# Altium schematic sheet mcu_and_input_power.SchDoc
size A2; SheetNumber: 2; SheetTotal: 2
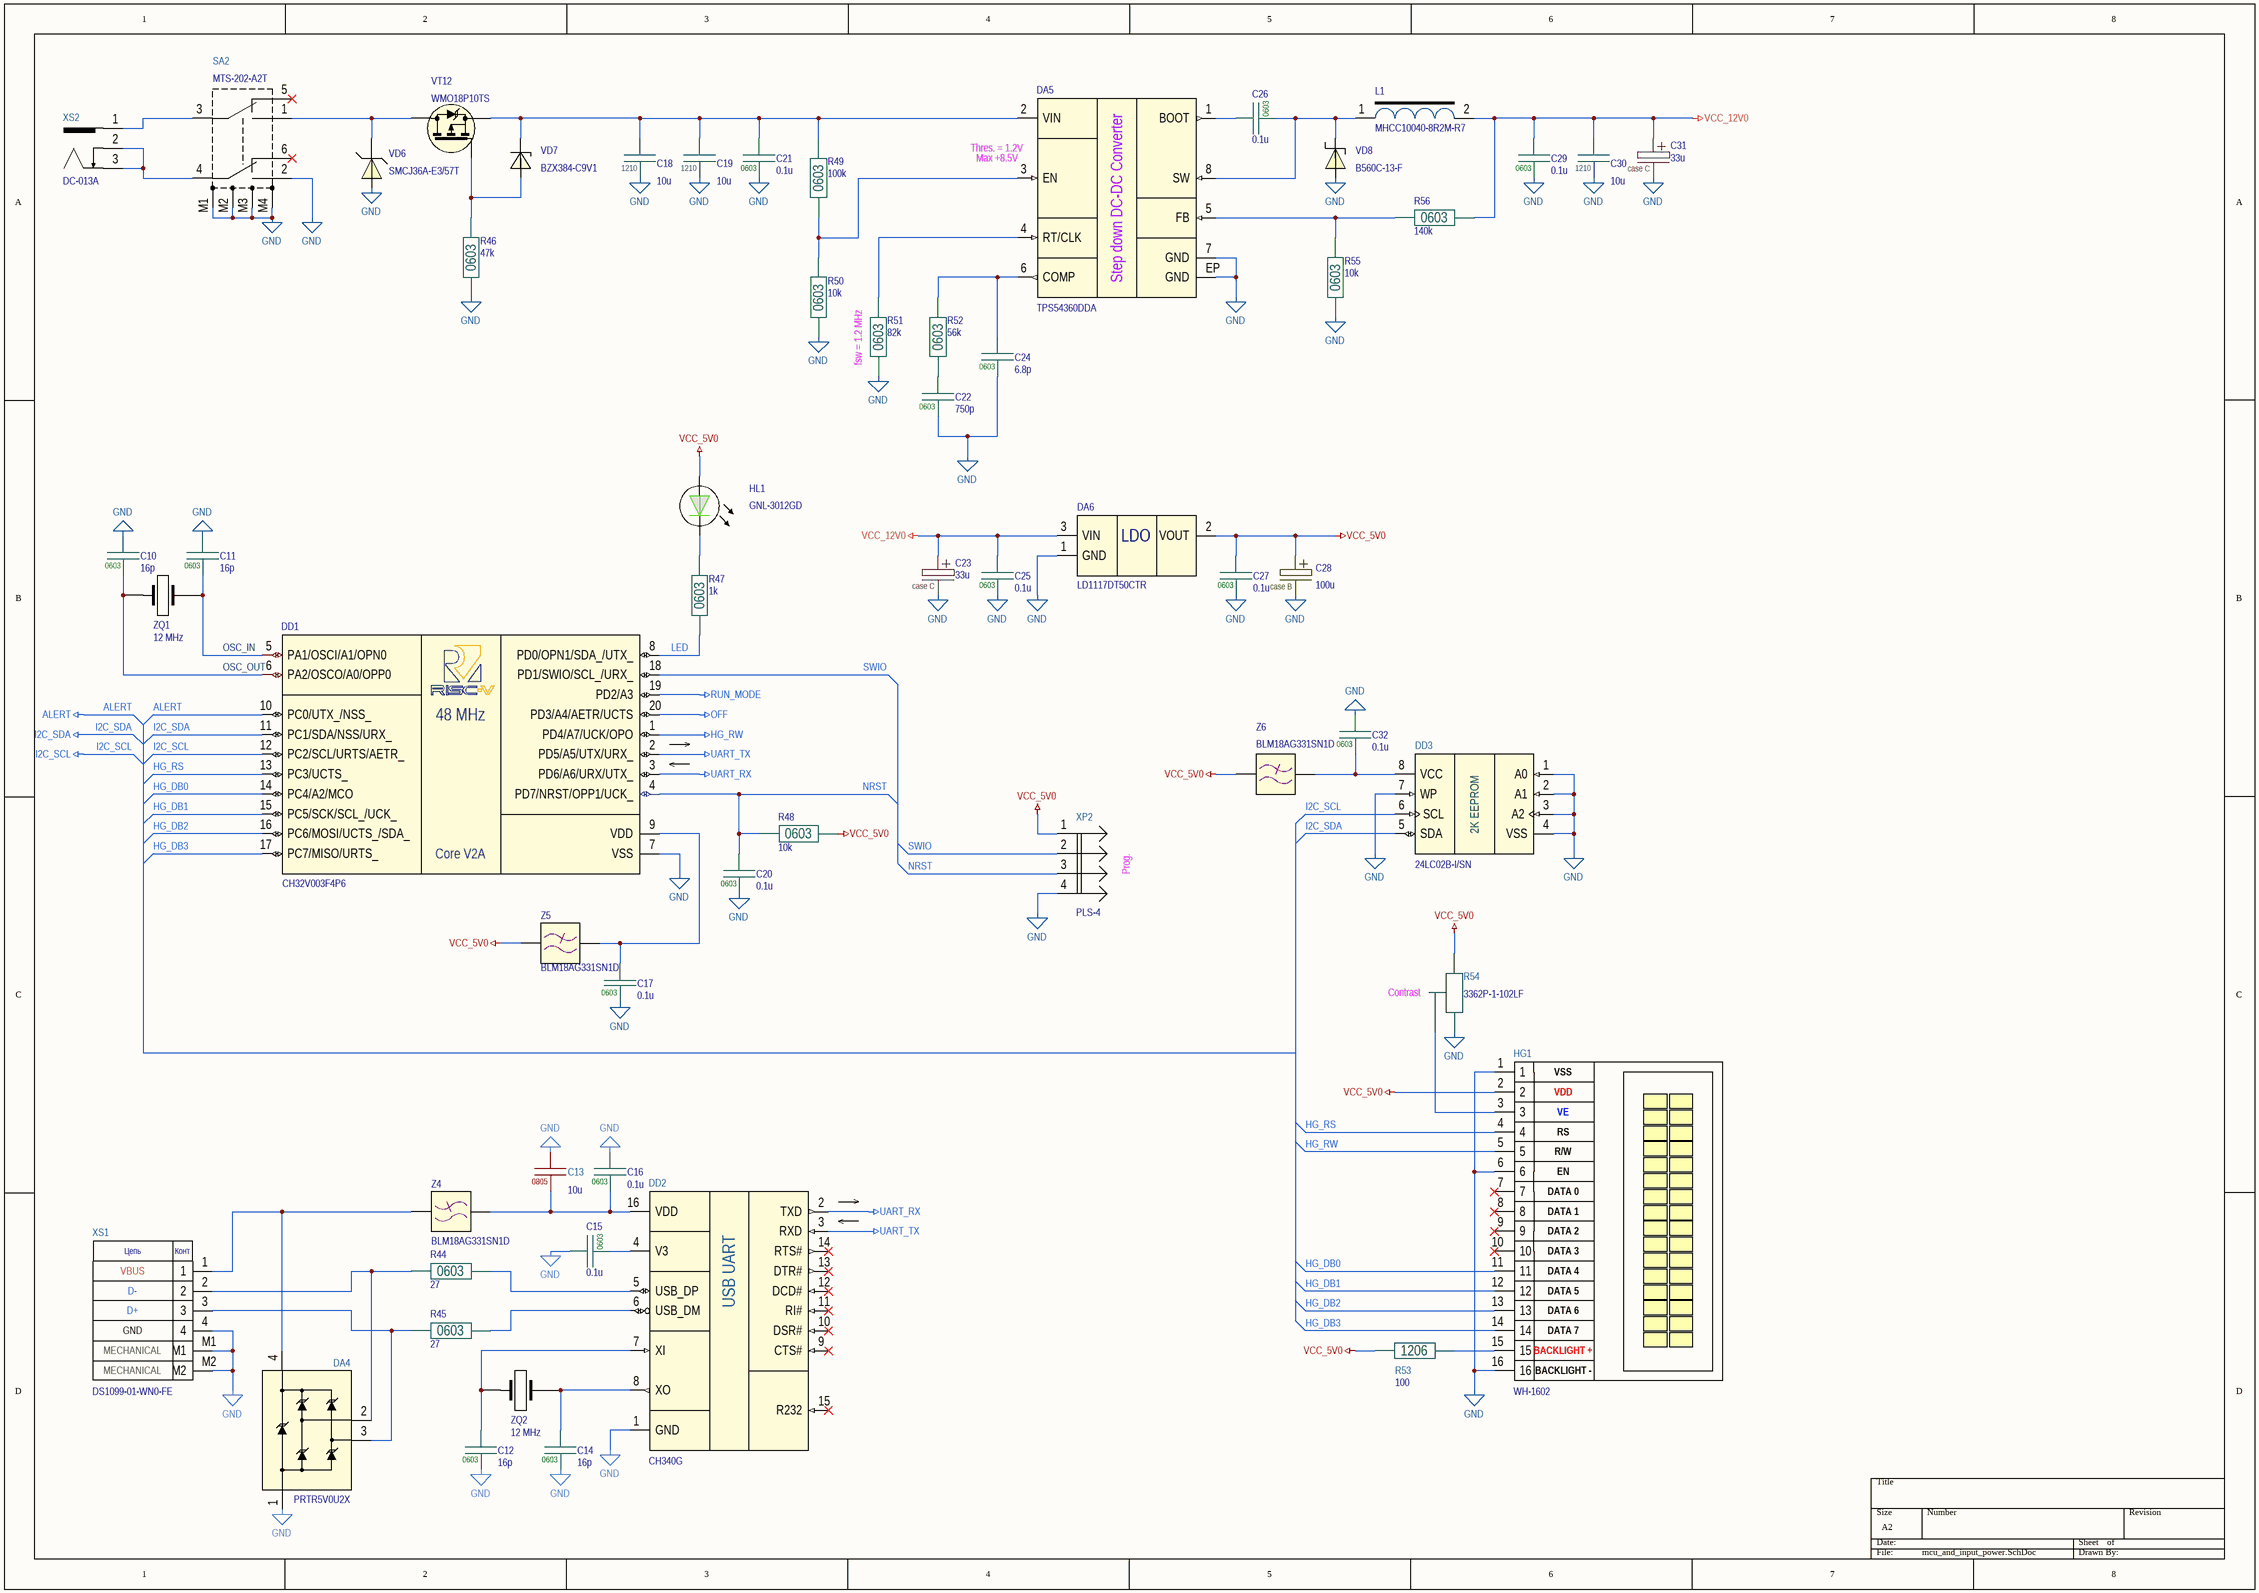
[diagram p0: mcu_and_input_power.SchDoc]

## Parts
C10  16p  Package: 0603  [CAP0603]
C11  16p  Package: 0603  [CAP0603]
C12  16p  Package: 0603  [CAP0603]
C13  10u  Package: 0805  [CAP0805-0.75]
C14  16p  Package: 0603  [CAP0603]
C15  0.1u  Package: 0603  [CAP0603]
C16  0.1u  Package: 0603  [CAP0603]
C17  0.1u  Package: 0603  [CAP0603]
C18  10u  Package: 1210  [CAP1210-2.2]
C19  10u  Package: 1210  [CAP1210-2.2]
C20  0.1u  Package: 0603  [CAP0603]
C21  0.1u  Package: 0603  [CAP0603]
C22  750p  Package: 0603  [CAP0603]
C23  33u  Package: case C  [CAP_CASE_C]
C24  6.8p  Package: 0603  [CAP0603]
C25  0.1u  Package: 0603  [CAP0603]
C26  0.1u  Package: 0603  [CAP0603]
C27  0.1u  Package: 0603  [CAP0603]
C28  100u  Package: case B  [CAP_CASE_B]
C29  0.1u  Package: 0603  [CAP0603]
C30  10u  Package: 1210  [CAP1210-2.2]
C31  33u  Package: case C  [CAP_CASE_C]
C32  0.1u  Package: 0603  [CAP0603]
DA4  PRTR5V0U2X  [SOT143]
DA5  TPS54360DDA  [SOIC-8EP]
DA6  LD1117DT50CTR  [TO-252-3]
DD1  CH32V003F4P6  [TSSOP-20]
DD2  CH340G  [SOIC-16]
DD3  24LC02B-I/SN  [SOIC-8]
HG1  WH-1602  [WH1602]
HL1  GNL-3012GD  [GNL-3012GD]
L1  MHCC10040-8R2M-R7  [MHCC10040]
R44  27  Package: 0603  [RES0603B]
R45  27  Package: 0603  [RES0603B]
R46  47k  Package: 0603  [RES0603B]
R47  1k  Package: 0603  [RES0603B]
R48  10k  Package: 0603  [RES0603B]
R49  100k  Package: 0603  [RES0603B]
R50  10k  Package: 0603  [RES0603B]
R51  82k  Package: 0603  [RES0603B]
R52  56k  Package: 0603  [RES0603B]
R53  100  Package: 1206  [RES1206C]
R54  3362P-1-102LF  [3362P]
R55  10k  Package: 0603  [RES0603B]
R56  140k  Package: 0603  [RES0603B]
SA2  MTS-202-A2T  [MTS-202-A2T]
VD6  SMCJ36A-E3/57T  [DO-214AB]
VD7  BZX384-C9V1  [SOD-323]
VD8  B560C-13-F  [DO-214AB]
VT12  WMO18P10TS  [TO-252-3]
XP2  PLS-4  [PLS-4]
XS1  DS1099-01-WN0-FE  [DS1099-01-WN0-FE]
XS2  DC-013A  [DC-013A]
Z4  BLM18AG331SN1D  [BLM0603P]
Z5  BLM18AG331SN1D  [BLM0603P]
Z6  BLM18AG331SN1D  [BLM0603P]
ZQ1  Frequency: 12 MHz  [HC-49/US_With_Hole]  (hidden comment: SJK-6C-12.000-16-30-50-B-50-H)
ZQ2  Frequency: 12 MHz  [HC-49/US_With_Hole]  (hidden comment: SJK-6C-12.000-16-30-50-B-50-H)

## Nets
ALERT: DD1.10(PC0/UTX_/NSS_)
GND: C10.2 C11.2 C12.1 C13.2 C14.1 C15.2 C16.2 C17.1 C18.1 C19.1 C20.1 C21.1 C22.1 C23.2 C24.1 C25.1 C27.1 C28.2 C29.1 C30.1 C31.2 C32.2 DA4.1(GND) DA5.7(GND) DA5.EP(GND) DA6.1(GND) DD1.7(VSS) DD2.1(GND) DD3.1(A0) DD3.2(A1) DD3.3(A2) DD3.4(VSS) DD3.7(WP) HG1.1 HG1.6 HG1.16 R46.1 R50.1 R51.2 R54.3 R55.1 SA2.2 SA2.M1 SA2.M2 SA2.M3 SA2.M4 VD6.1(C) VD8.1(A) XP2.4 XS1.4 XS1.M1 XS1.M2
HG_RW: DD1.1(PD4/A7/UCK/OPO) HG1.5
I2C_SCL: DD1.12(PC2/SCL/URTS/AETR_) DD3.6(SCL)
I2C_SDA: DD1.11(PC1/SDA/NSS/URX_) DD3.5(SDA)
OFF: DD1.20(PD3/A4/AETR/UCTS)
RUN_MODE: DD1.19(PD2/A3)
UART_RX: DD1.3(PD6/A6/URX/UTX_) DD2.2(TXD)
UART_TX: DD1.2(PD5/A5/UTX/URX_) DD2.3(RXD)
VCC_5V0: C27.2 C28.1 DA6.2(VOUT) HG1.2 HL1.2 R48.2 R53.1 R54.1 XP2.1 Z5.2 Z6.2
VCC_12V0: C23.1 C25.2 C29.2 C30.2 C31.1 DA6.3(VIN) L1.2 R56.2
HG_DB0: DD1.14(PC4/A2/MCO) HG1.11
HG_DB1: DD1.15(PC5/SCK/SCL_/UCK_) HG1.12
HG_DB2: DD1.16(PC6/MOSI/UCTS_/SDA_) HG1.13
HG_DB3: DD1.17(PC7/MISO/URTS_) HG1.14
HG_RS: DD1.13(PC3/UCTS_) HG1.4
LED: DD1.8(PD0/OPN1/SDA_/UTX_) R47.1
NRST: C20.2 DD1.4(PD7/NRST/OPP1/UCK_) R48.1 XP2.3
OSC_IN: C11.1 DD1.5(PA1/OSCI/A1/OPN0) ZQ1.2(XTAL1)
OSC_OUT: C10.1 DD1.6(PA2/OSCO/A0/OPP0) ZQ1.1(XTAL0)
SWIO: DD1.18(PD1/SWIO/SCL_/URX_) XP2.2
NetC12_2: C12.2 DD2.7(XI) ZQ2.1(XTAL0)
NetC13_1: C13.1 C16.1 DD2.16(VDD) Z4.2
NetC14_2: C14.2 DD2.8(XO) ZQ2.2(XTAL1)
NetC15_1: C15.1 DD2.4(V3)
NetC17_2: C17.2 DD1.9(VDD) Z5.1
NetC18_2: C18.2 C19.2 C21.2 DA5.2(VIN) R49.1 VD7.1 VT12.3(S)
NetC22_2: C22.2 R52.2
NetC24_2: C24.2 DA5.6(COMP) R52.1
NetC26_1: C26.1 DA5.8(SW) L1.1 VD8.2(C)
NetC26_2: C26.2 DA5.1(BOOT)
NetC32_1: C32.1 DD3.8(VCC) Z6.1
NetDA4_2: DA4.2(IO1) R44.1 XS1.2
NetDA4_3: DA4.3(IO2) R45.1 XS1.3
NetDA4_4: DA4.4(VCC) XS1.1 Z4.1
NetDA5_3: DA5.3(EN) R49.2 R50.2
NetDA5_4: DA5.4(RT/CLK) R51.1
NetDA5_5: DA5.5(FB) R55.2 R56.1
NetDD2_5: DD2.5(USB_DP) R44.2
NetDD2_6: DD2.6(USB_DM) R45.2
NetHG1_3: HG1.3 R54.2
NetHG1_15: HG1.15 R53.2
NetHL1_1: HL1.1 R47.2
NetR46_2: R46.2 VD7.2 VT12.1(G)
NetSA2_1: SA2.1 VD6.2(A) VT12.2(D)
NetSA2_3: SA2.3 XS2.1
NetSA2_4: SA2.4 XS2.2 XS2.3

Not connected (* = marked no-connect by the designer): DD2 9(CTS#)* 10(DSR#)* 11(RI#)* 12(DCD#)* 13(DTR#)* 14(RTS#)* 15(R232)*; HG1 7* 8* 9* 10*; SA2 5* 6*

## Notes on the sheet
- (near DA5) Thres. = 1.2V
- (near DA5) Max +8.5V
- (near R51) fsw = 1.2 MHz
- Prog.
- (near R54) Contrast
- (in symbol 24LC02B-I/SN) 2K EEPROM
- (in symbol CH32V003F4P6) 48 MHz; Core V2A
- (in symbol CH340G) USB UART
- (in symbol DS1099-01-WN0-FE) Цепь; Конт; VBUS; D-; D+; GND; MECHANICAL
- (in symbol LD1117DT50CTR) LDO
- (in symbol TPS54360DDA) Step down DC-DC Converter
- (in symbol WH-1602) VSS; VDD; VE; RS; R/W; EN; DATA 0; DATA 1; DATA 2; DATA 3; DATA 4; DATA 5; DATA 6; DATA 7; BACKLIGHT +; BACKLIGHT -

## Library data of the parts
C10-C12 C14 = C0603: Capacitors 0603 package case; Part Number: CL10C120JB8NNNC; Manufacturer: Samsung; Tolerance: ± 5 %; Dielectric: NP0; Voltage: 50V; Value: 16p; Value on schem: 16p
C13 = C0805: Capacitors 0805 package case; Part Number: CL21B106KOQNNNE; Manufacturer: Samsung Sdi Co. Ltd; Tolerance: ± 10 %; Dielectric: X7R; Voltage: 16V; Value: 10u; Value on schem: 10u
C15-C17 C20 C21 C25-C27 C29 C32 = C0603: Capacitors 0603 package case; Part Number: CL10B104KB8NNNC; Manufacturer: Samsung Sdi Co. Ltd; Tolerance: ± 10 %; Dielectric: X7R; Voltage: 50V; Value: 0.1u; Value on schem: 0.1u
C18 C19 C30 = C1210: Capacitors 1210 package case; Part Number: GRM32ER71J106KA12L; Manufacturer: Murata Electronics Inc.; Tolerance: ± 10 %; Dielectric: X7R; Voltage: 100V; Value: 10u; Value on schem: 10u
C22 = C0603: Capacitors 0603 package case; Part Number: CL10C751JB8NNNC; Manufacturer: Samsung Sdi Co. Ltd; Tolerance: ± 5 %; Dielectric: NP0; Voltage: 50V; Value: 750p; Value on schem: 750p
C23 C31 = C_CASEC: Tantalum capacitors case C; Part Number: 293D336X9020C2TE3; Manufacturer: VISHAY; Tolerance: ± 10 %; Voltage: 20V; ESR Ohm@kHz: 1.0; Value: 33u; Value on schem: 33u
C24 = C0603: Capacitors 0603 package case; Part Number: CL10C6R8CB8NNNC; Manufacturer: Samsung Sdi Co. Ltd; Tolerance: ± 0.25 pF; Dielectric: NP0; Voltage: 50V; Value: 6.8p; Value on schem: 6.8p
C28 = C_CASEB: Tantalum capacitors case B; Part Number: 293D107X0010B2TE3; Manufacturer: Vishay Intertechnology Inc.; Tolerance: ± 10 %; Voltage: 10V; ESR: 2.5Ohm @ 100 kHz; Value: 100u; Value on schem: 100u; Series: 293D
DA4 = PRTR5V0U2X: Ultra low capacitance double rail-to-rail ESD protection diode; Manufacturer: NXP USA Inc.; Part Number: PRTR5V0U2X; Package: SOT-143
DA5 = TPS54360DDA: 60-V Input, 3.5-A, Step-Down DC/DC Converter With Eco-Mode; Manufacturer: Texas Instruments; Part Number: TPS54360DDA; Package: SOIC-8
DA6 = LD1117DT50CTR: Low drop positive voltage regulator; Manufacturer: STMicroelectronics; Part Number: LD1117DT50CTR; Package: TO-252-3
DD1 = CH32V003F4P6: RISC-V MCU 48MHz with 16KB flash, 2KB RAM; Manufacturer: WinChipHead; Package: TSSOP-20; Part Number: CH32V003F4P6
DD2 = CH340G: USB to Serial Port Chip; Manufacturer: WinChipHead; Package: SO-16; Part Number: CH340G
DD3 = 24LC02B-I/SN: 2K I2C Serial EEPROM; Manufacturer: Microchip Technology; Package: SOIC-8; Part Number: 24LC02B-I/SN
HG1 = WH-1602: 1602 Display with 16 pin PBS connector; Part Number: WH-1602
HL1 = GNL-3012GD: Standard Brightness 3mm LED; Manufacturer: G-Nor Optoelectronics; Color: Green, 565 nm; Package: 3mm; Part Number: GNL-3012GD
L1 = MHCC10040-8R2M-R7: Shielded SMD Power Inductor; Manufacturer: Chilisin Elec; RDC: 30 mOhm; Irms Typ: 6 A; Isat Typ: 9 A; Inductance @ 100 kHz: 8.2 uH; Part Number: MHCC10040-8R2M-R7; Package: 10.1x11.6x4 mm
R44 R45 = R0603: Resistor 0603 package case; Part Number: RC0603FR-0727RL; Manufacturer: Yageo; Tolerance: ± 1 %; Value: 27; Value on schem: 27
R46 = R0603: Resistor 0603 package case; Part Number: RC0603FR-0747KL; Manufacturer: Yageo; Tolerance: ± 1 %; Temperature coefficient: ± 100 ppm/°C; Voltage: 75V; Value: 47k; Value on schem: 47k
R47 = R0603: Resistor 0603 package case; Part Number: RC0603FR-071KL; Manufacturer: Yageo; Tolerance: ± 1 %; Temperature coefficient: ± 100 ppm/°C; Voltage: 75V; Value: 1k; Value on schem: 1k
R48 R50 R55 = R0603: Resistor 0603 package case; Part Number: RC0603FR-0710KL; Manufacturer: Yageo; Tolerance: ± 1 %; Temperature coefficient: ± 100 ppm/°C; Voltage: 75V; Value: 10k; Value on schem: 10k
R49 = R0603: Resistor 0603 package case; Part Number: RC0603FR-07100KL; Manufacturer: Yageo; Tolerance: ± 1 %; Value: 100k; Value on schem: 100k
R51 = R0603: Resistor 0603 package case; Part Number: RC0603FR-0782KL; Manufacturer: Yageo; Tolerance: ± 1 %; Value: 82k; Value on schem: 82k
R52 = R0603: Resistor 0603 package case; Part Number: RC0603FR-0756KL; Manufacturer: Yageo; Tolerance: ± 1 %; Value: 56k; Value on schem: 56k
R53 = R1206: Resistor 1206 package case; Manufacturer: Yageo; Part Number: RC1206FR-07100RL; Tolerance: ± 1 %; Voltage: 200 V; Temperature Coefficient: ± 100 ppm/°C; Value: 100; Value on schem: 100
R54 = 3362P-1-102LF: TRIMMER 1K OHM 0.5W PC PIN TOP; Manufacturer: Bourns Inc.; Part Number: 3362P-1-102LF; Power Dissipation: 0.5W; Value: 1k
R56 = R0603: Resistor 0603 package case; Part Number: RC0603FR-07140KL; Manufacturer: Yageo; Tolerance: ± 1 %; Value: 140k; Value on schem: 140k
SA2 = MTS-202-A2T: Switch; Manufacturer: RUICHI; Part Number: MTS-202-A2T
VD6 = SMCJ36A-E3/57T: 36V Transient Voltage Suppressors; Manufacturer: Vishay; Part Number: SMCJ36A-E3/57T; Package: DO-214AB-2 (SMС)
VD7 = BZX384-C9V1: Voltage regulator diodes 9.1V; Package: SOD-323; Part Number: BZX384-C9V1
VD8 = B560C-13-F: Diode Schottky 60V, 5A; Manufacturer: Diodes Incorporated; Package: SMC/DO-214AB; Part Number: B560C-13-F
VT12 = WMO18P10TS: P-Channel MOSFET, -100V, -18A; Manufacturer: Wayon; Part Number: WMO18P10TS; Package: TO-252
XS1 = DS1099-01-WN0-FE: USB Type B Vertical Female; Manufacturer: Connfly; Part Nubmer: DS1099-01-WN0-FE
XS2 = DC-013A: Straight DC Power Receptacle Connector 2mm x 6.4mm; Part Number: DC-013A
Z4-Z6 = BLM18AG331SN1D: Power line filter, imperdance 330 Ohm (current 05A); Part Number: BLM18AG331SN1D; Package: 0603
ZQ1 ZQ2 = HC-49: Crystal resonator; Manufacturer: SJK; Frequency Tolerance: ±30ppm; Load Capacitance: 16 pF; Package: HC-49US; Part Number: SJK-6C-12.000-16-30-50-B-50-H
XP2 = PLS-4: Value: PLS-4